# Altium project board.PrjPCB
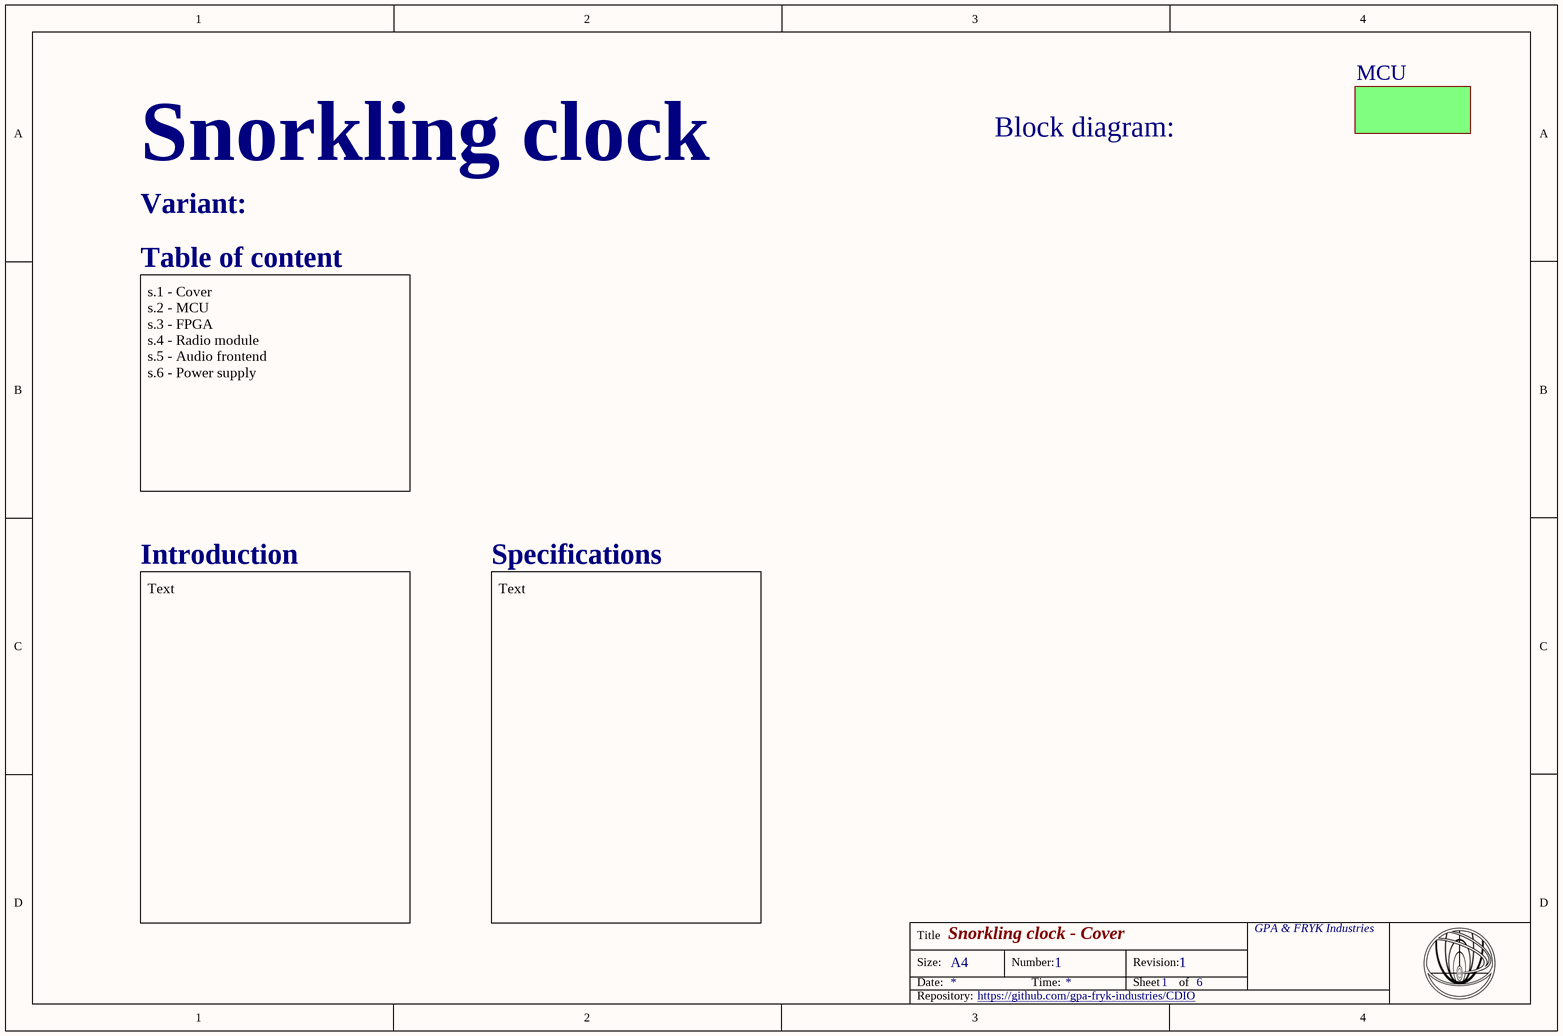
[diagram p0: cover.SchDoc]
project_name: Snorkling clock; project_revision: 1; project_vcs_url: https://github.com/gpa-fryk-industries/CDIO
6 sheets, 96 parts. Net scope: hierarchical (ports join the sheet entries above them; power ports are global).
Board file: board.PcbDoc
Sheets:
  cover.SchDoc
    MCU = mcu.SchDoc
      POWER = power.SchDoc
      FPGA = fpga.SchDoc
      RADIO = radio.SchDoc
      AUDIO = audio.SchDoc

## Sheet cover.SchDoc
size A4; Organization: GPA & FRYK Industries; DocumentNumber: 1; Revision: REV 0; SheetNumber: 1; SheetTotal: 6

### Sub-sheets
MCU = mcu.SchDoc: no entries

### Notes on the sheet
- Block diagram:
- Table of content
- s.1 - Cover
  s.2 - MCU
  s.3 - FPGA
  s.4 - Radio module
  s.5 - Audio frontend
  s.6 - Power supply
- Introduction
- Specifications
- Text
- Variant:
- Title
- Size:
- Date:
- A4
- Number:
- Time:
- Revision:
- Sheet
- of
- Repository:

## Sheet mcu.SchDoc: MCU
size A4; Organization: GPA & FRYK Industries; DocumentNumber: 2; Revision: REV 0; SheetNumber: 2; SheetTotal: 6
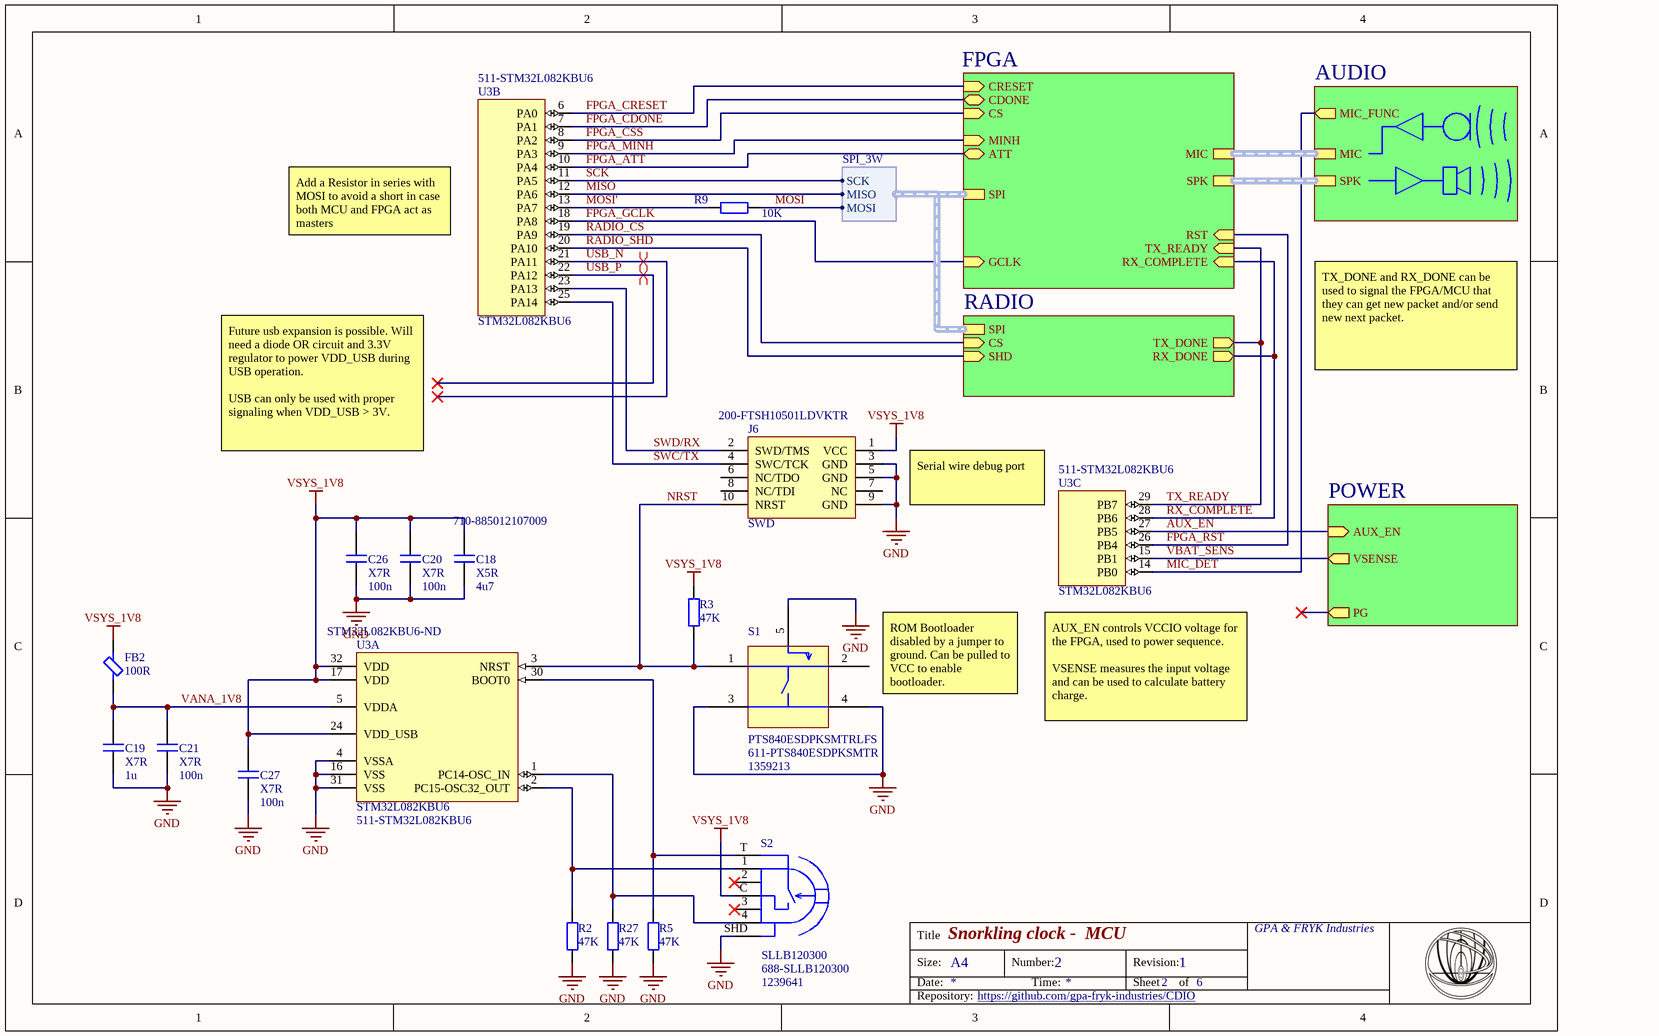
[diagram p1: mcu.SchDoc]

### Parts
C18  value 4u7  type: X5R  Supplier Part Number 1: 710-885012107009  [CAPC2012X11N]  (hidden comment: cap)
C19  value 1u  type: X7R  [CAPC2012X11N]  (hidden comment: cap)
C20  value 100n  type: X7R  [CAPC1005X06N]  (hidden comment: cap)
C21  value 100n  type: X7R  [CAPC1005X06N]  (hidden comment: cap)
C26  value 100n  type: X7R  [CAPC1005X06N]  (hidden comment: cap)
C27  value 100n  type: X7R  [CAPC1005X06N]  (hidden comment: cap)
FB2  value 100R  [INDC1005X06N]  (hidden comment: ferrite)
J6  SWD  Supplier Part Number 1: 200-FTSH10501LDVKTR  [hdr_2x5_50mil]
R2  value 47K  [RESC1005X04N]  (hidden comment: res)
R3  value 47K  [RESC1005X04N]  (hidden comment: res)
R5  value 47K  [RESC1005X04N]  (hidden comment: res)
R9  value 10K  [RESC1005X04N]  (hidden comment: res)
R27  value 47K  [RESC1005X04N]  (hidden comment: res)
S1  PTS840ESDPKSMTRLFS  Supplier Part Number 1: 611-PTS840ESDPKSMTR  Supplier Part Number 2: 1359213  [PCBComponent_1]
S2  SLLB120300  Supplier Part Number 1: 688-SLLB120300  Supplier Part Number 2: 1239641  [sllb120300]
U3  STM32L082KBU6  Supplier Part Number 1: 511-STM32L082KBU6  Supplier Part Number 2: STM32L082KBU6-ND  [QFN50P500X500X60_HS-33N]  (parts A,B,C of 3)

### Sub-sheets
AUDIO = audio.SchDoc: MIC (harness PDM), SPK (harness PWM_D), MIC_FUNC (out)
FPGA = fpga.SchDoc: SPI (harness SPI_3W), MIC (harness PDM), SPK (harness PWM_D), CS (in), CDONE (bidir), GCLK (in), CRESET (in), ATT (bidir), MINH (in), TX_READY (in), RX_COMPLETE (in), RST (in)
POWER = power.SchDoc: AUX_EN (in), VSENSE (out), PG (out)
RADIO = radio.SchDoc: SPI (harness SPI_3W), CS (in), TX_DONE (out), RX_DONE (out), SHD (in)

### Harnesses
SPI_3W: MOSI, MISO, SCK

### Nets
GND: C18.1 C19.1 C20.2 C21.2 C26.2 C27.2 J6.3(GND) J6.5(GND) J6.9(GND) R2.1 R5.1 R27.1 S1.3 S1.4 S1.5 S2.SHD U3.4(VSSA) U3.16(VSS) U3.31(VSS)
VSYS_1V8: C18.2 C20.1 C26.1 C27.1 FB2.2 J6.1(VCC) R3.2 S2.C U3.17(VDD) U3.24(VDD_USB) U3.32(VDD)
AUX_EN: U3.27(PB5) ; sheet POWER/AUX_EN
FPGA_ATT: U3.10(PA4) ; sheet FPGA/ATT
FPGA_CDONE: U3.7(PA1) ; sheet FPGA/CDONE
FPGA_CRESET: U3.6(PA0) ; sheet FPGA/CRESET
FPGA_CSS: U3.8(PA2) ; sheet FPGA/CS
FPGA_GCLK: U3.18(PA8) ; sheet FPGA/GCLK
FPGA_MINH: U3.9(PA3) ; sheet FPGA/MINH
FPGA_RST: U3.26(PB4) ; sheet FPGA/RST
MIC_DET: U3.14(PB0) ; sheet AUDIO/MIC_FUNC
MISO: U3.12(PA6) ; sheet FPGA/SPI.MISO
MOSI: R9.2 ; sheet FPGA/SPI.MOSI
MOSI': R9.1 U3.13(PA7)
NRST: J6.10(NRST) R3.1 S1.1 U3.3(NRST)
RADIO_CS: U3.19(PA9) ; sheet RADIO/CS
RADIO_SHD: U3.20(PA10) ; sheet RADIO/SHD
RX_COMPLETE: U3.28(PB6) ; sheet FPGA/RX_COMPLETE, sheet RADIO/RX_DONE
SCK: U3.11(PA5) ; sheet FPGA/SPI.SCK  [project net P_SCK]
SWC/TX: J6.4(SWC/TCK) U3.25(PA14)
SWD/RX: J6.2(SWD/TMS) U3.23(PA13)
TX_READY: U3.29(PB7) ; sheet FPGA/TX_READY, sheet RADIO/TX_DONE
USB_N: U3.21(PA11)
USB_P: U3.22(PA12)
VANA_1V8: C19.2 C21.1 FB2.1 U3.5(VDDA)
VBAT_SENS: U3.15(PB1) ; sheet POWER/VSENSE
NetR2_2: R2.2 S2.1 U3.2(PC15-OSC32_OUT)
NetR5_2: R5.2 S2.T U3.30(BOOT0)
NetR27_2: R27.2 S2.4 U3.1(PC14-OSC_IN)

Not connected (* = marked no-connect by the designer): J6 6(NC/TDO) 7(NC) 8(NC/TDI); S1 2; S2 2* 3*

### Buses and harness runs
harness sheet AUDIO/MIC = sheet FPGA/MIC
harness sheet AUDIO/SPK = sheet FPGA/SPK
harness sheet FPGA/SPI = sheet RADIO/SPI

### Layout directives
differential pair: USB_N, USB_P

### Notes on the sheet
- Add a Resistor in series with MOSI to avoid a short in case both MCU and FPGA act as masters
- TX_DONE and RX_DONE can be used to signal the FPGA/MCU that they can get new packet and/or send new next packet.
- Future usb expansion is possible. Will need a diode OR circuit and 3.3V regulator to power VDD_USB during USB operation.
  USB can only be used with proper signaling when VDD_USB > 3V.
- Serial wire debug port
- ROM Bootloader disabled by a jumper to ground. Can be pulled to VCC to enable bootloader.
- (near U3) AUX_EN controls VCCIO voltage for the FPGA, used to power sequence.
  VSENSE measures the input voltage and can be used to calculate battery charge.
- Title
- Size:
- Date:
- A4
- Number:
- Time:
- Revision:
- Sheet
- of
- Repository:

### Library data of the parts
C18-C21 C26 C27 = cap: Capacitor; voltage: *; #digikey: *; #mouser: *; Supplier 1: Mouser
  C19: Supplier Part Number 1: 77-VJ0805Y105MXQTBC
  C20 C21 C26 C27: Supplier Part Number 1: 81-GCM155R71H103KA5J
FB2 = ferrite: Inductor; #digikey: *; #mouser: *; Supplier 1: Mouser; Supplier Part Number 1: 810-MMZ1005S102HT000
J6 = hdr_swd: SWD Header; Supplier 1: Mouser
R2 R3 R5 R9 R27 = res: Resistor; power: *; voltage: *; #digikey: *; #mouser: *
S1 = pts840esdpksmtrlfs: Microminiature SMT Side Actuated tactile switch; ComponentLink1Description: datasheet; ComponentLink1URL: https://www.mouser.se/datasheet/2/60/pts840-1280343.pdf; Supplier 1: Mouser; Supplier 2: RSComponents
S2 = sllb120300: Compact and low-profile horizontal type for various applications; ComponentLink1Description: datasheet; ComponentLink1URL: https://www.mouser.se/datasheet/2/15/SLLB-1370969.pdf; Supplier 1: Mouser; Supplier 2: RSComponents
U3 = stm32l082kbu6: Ultra-low-power 32-bit MCU Arm-based Cortex-M0+, up to 192KB / Flash, 20KB SRAM, 6KB EEPROM, USB, ADC, DACs, AES; ComponentLink1Description: datasheet; ComponentLink1URL: https://www.mouser.se/datasheet/2/389/stm32l082kb-956309.pdf; Supplier 1: Mouser; Supplier 2: Digi-Key

## Sheet power.SchDoc: Power supply
size A4; Organization: GPA & FRYK Industries; DocumentNumber: 6; Revision: REV 0; SheetNumber: 6; SheetTotal: 6
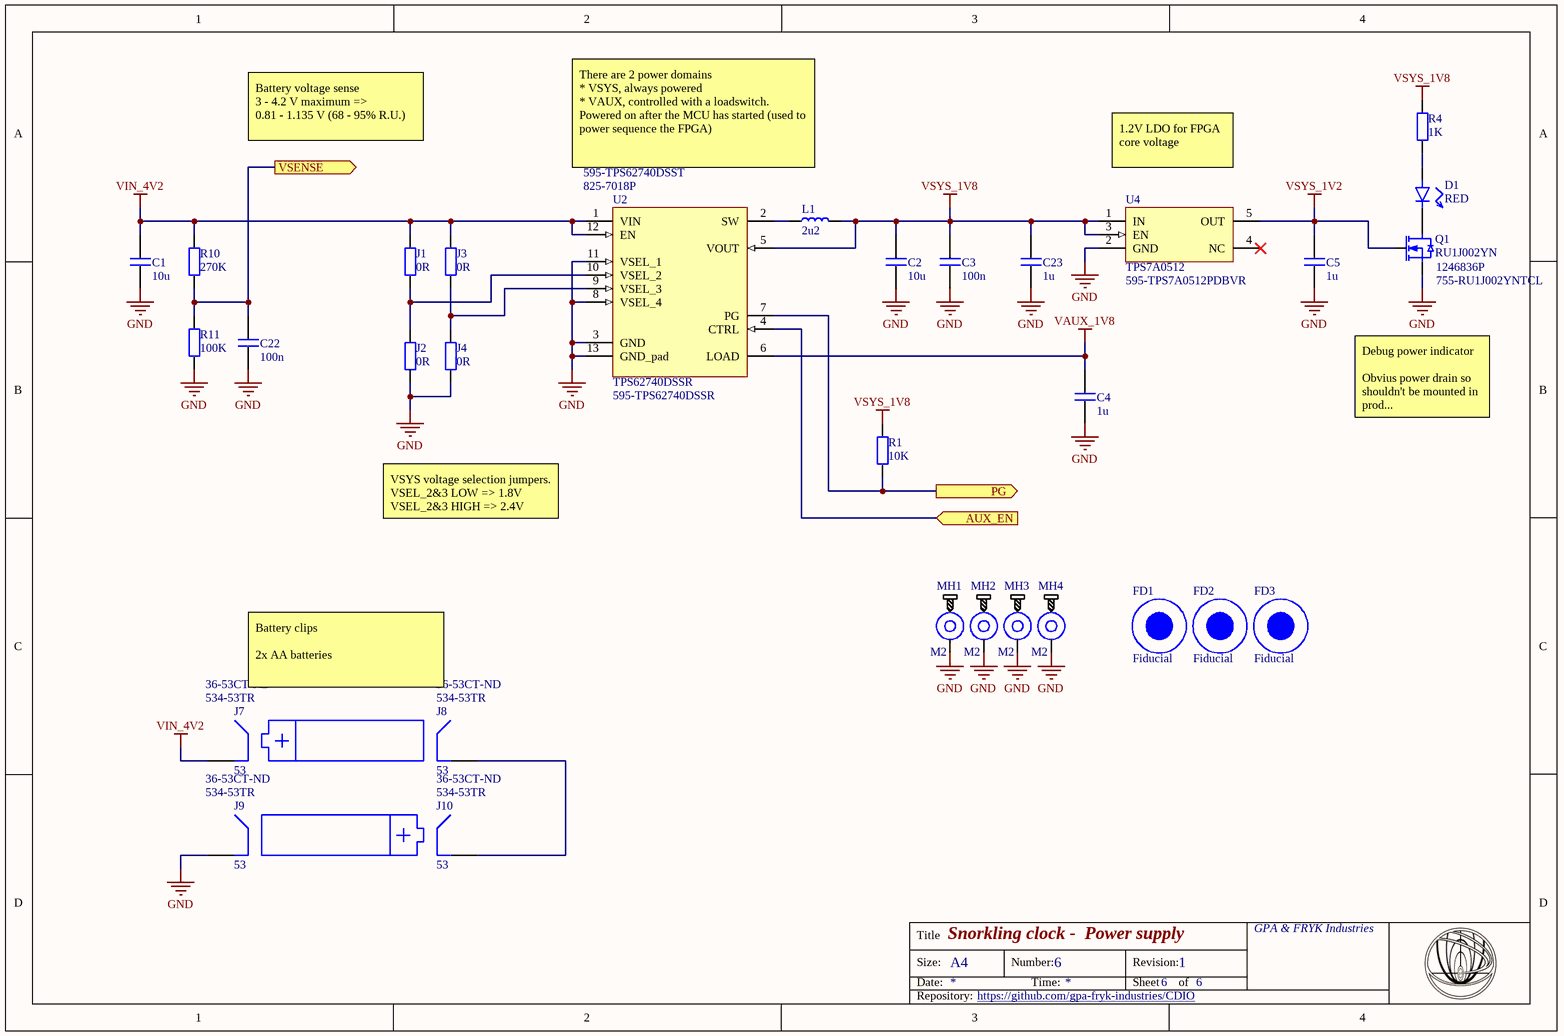
[diagram p2: power.SchDoc]

### Parts
C1  value 10u  [CAPC3216X14N]  (hidden comment: cap)
C2  value 10u  [CAPC3216X14N]  (hidden comment: cap)
C3  value 100n  [CAPC1005X06N]  (hidden comment: cap)
C4  value 1u  [CAPC2012X11N]  (hidden comment: cap)
C5  value 1u  [CAPC2012X11N]  (hidden comment: cap)
C22  value 100n  [CAPC1005X06N]  (hidden comment: cap)
C23  value 1u  [CAPC2012X11N]  (hidden comment: cap)
D1  value RED  [CAPCP1005X06N]  (hidden comment: led)
FD1  Fiducial  [fiducial_1_3]  (no BOM)
FD2  Fiducial  [fiducial_1_3]  (no BOM)
FD3  Fiducial  [fiducial_1_3]  (no BOM)
J1  value 0R  [RESC1005X04N]  (hidden comment: res)
J2  value 0R  [RESC1005X04N]  (hidden comment: res)
J3  value 0R  [RESC1005X04N]  (hidden comment: res)
J4  value 0R  [RESC1005X04N]  (hidden comment: res)
J7  53  Supplier Part Number 1: 534-53TR  Supplier Part Number 2: 36-53CT-ND  [ke53]
J8  53  Supplier Part Number 1: 534-53TR  Supplier Part Number 2: 36-53CT-ND  [ke53]
J9  53  Supplier Part Number 1: 534-53TR  Supplier Part Number 2: 36-53CT-ND  [ke53]
J10  53  Supplier Part Number 1: 534-53TR  Supplier Part Number 2: 36-53CT-ND  [ke53]
L1  value 2u2  [INDC3216X20N]  (hidden comment: ind)
MH1  M2  [mount_m2l]  (no BOM)
MH2  M2  [mount_m2l]  (no BOM)
MH3  M2  [mount_m2l]  (no BOM)
MH4  M2  [mount_m2l]  (no BOM)
Q1  RU1J002YN  Supplier Part Number 1: 1246836P  Supplier Part Number 2: 755-RU1J002YNTCL  [SOTFL65P210X105-3N]
R1  value 10K  [RESC1005X04N]  (hidden comment: res)
R4  value 1K  [RESC1005X04N]  (hidden comment: res)
R10  value 270K  [RESC1005X04N]  (hidden comment: res)
R11  value 100K  [RESC1005X04N]  (hidden comment: res)
U2  TPS62740DSSR  Supplier Part Number 1: 595-TPS62740DSSR  Supplier Part Number 2: 825-7018P  Supplier Part Number 3: 595-TPS62740DSST  [SON50P200X80_HS-13N]
U4  TPS7A0512  Supplier Part Number 1: 595-TPS7A0512PDBVR  [SOT95P280X145-5N]

### Ports
AUX_EN (in), PG (out), VSENSE (out)

### Nets
GND: C1.1 C2.1 C3.1 C4.1 C5.1 C22.1 C23.1 J2.1 J4.1 J9.1 MH1.1 MH2.1 MH3.1 MH4.1 Q1.2(S) R11.1 U2.3(GND) U2.8(VSEL_4) U2.11(VSEL_1) U2.13(GND_pad) U4.2(GND)
VAUX_1V8: C4.2 U2.6(LOAD)
VIN_4V2: C1.2 J1.2 J3.2 J7.1 R10.2 U2.1(VIN) U2.12(EN)
VSYS_1V2: C5.2 Q1.1(G) U4.5(OUT)
VSYS_1V8: C2.2 C3.2 C23.2 L1.2 R1.2 R4.2 U2.5(VOUT) U4.1(IN) U4.3(EN)
AUX_EN: U2.4(CTRL) ; port AUX_EN
VBAT_SENS: C22.2 R10.1 R11.2 ; port VSENSE
NetD1_A: D1.A R4.1
NetD1_C: D1.C Q1.3(D)
NetJ1_1: J1.1 J2.2 U2.10(VSEL_2)
NetJ3_1: J3.1 J4.2 U2.9(VSEL_3)
NetJ8_1: J8.1 J10.1
NetL1_1: L1.1 U2.2(SW)
NetR1_1: R1.1 U2.7(PG) ; port PG

Not connected (* = marked no-connect by the designer): U4 4(NC)*

### Notes on the sheet
- Battery voltage sense
  3 - 4.2 V maximum =>
  0.81 - 1.135 V (68 - 95% R.U.)
- There are 2 power domains
  * VSYS, always powered
  * VAUX, controlled with a loadswitch. Powered on after the MCU has started (used to power sequence the FPGA)
- 1.2V LDO for FPGA core voltage
- Debug power indicator
  Obvius power drain so shouldn't be mounted in prod...
- VSYS voltage selection jumpers.
  VSEL_2&3 LOW => 1.8V
  VSEL_2&3 HIGH => 2.4V
- Battery clips
  2x AA batteries
- Title
- Size:
- Date:
- A4
- Number:
- Time:
- Revision:
- Sheet
- of
- Repository:

### Library data of the parts
C1 C2 = cap: Capacitor; type: X5R; voltage: *; #digikey: *; #mouser: *; Supplier 1: Mouser; Supplier Part Number 1: 810-C3216X5R1C106M
C3-C5 C22 C23 = cap: Capacitor; type: X7R; voltage: *; #digikey: *; #mouser: *; Supplier 1: Mouser
  C3 C22: Supplier Part Number 1: 81-GCM155R71H103KA5J
  C4 C5 C23: Supplier Part Number 1: 77-VJ0805Y105MXQTBC
D1 = led: pin to pad: A>1 C>2; Supplier 1: RSComponents; Supplier Part Number 1: 1332893P; Supplier 2: Mouser; Supplier Part Number 2: 755-SML-P12M2TT86R
J1-J4 R1 R4 R10 R11 = res: Resistor; power: *; voltage: *; #digikey: *; #mouser: *
J7-J10 = ke53: Cylindrical Battery Contacts, Clips, Holders & Springs SMT Battery clip FOR AA; ComponentLink1Description: datasheet; ComponentLink1URL: https://www.mouser.se/datasheet/2/215/3-745929.pdf; Supplier 1: Mouser; Supplier 2: Digi-Key
L1 = ind: Inductor; current: *; #digikey: *; #mouser: *; Supplier 1: Mouser; Supplier Part Number 1: 963-LB3218T2R2M; Supplier 2: RSComponents; Supplier Part Number 2: 755-4703
MH1-MH4 = mounting_hole: Mounting hole
Q1 = ru1j002yn: N-channel 50V 200mA Small signal MOSFET; ComponentLink1Description: datasheet; ComponentLink1URL: https://www.mouser.se/datasheet/2/348/ru1j002yn-e-1018335.pdf; Supplier 1: RSComponents; Supplier 2: Mouser
U2 = tps62740dssr: TPS6274x 360nA IQ Step Down Converter For Low Power Applications; ComponentLink1Description: datasheet; ComponentLink1URL: http://www.ti.com/general/docs/suppproductinfo.tsp?distId=26&gotoUrl=http%3A%2F%2Fwww.ti.com%2Flit%2Fgpn%2Ftps62740; Supplier 1: Mouser; Supplier 2: RSComponents; Supplier 3: Mouser
U4 = tps7a0512pdbvr: TPS7A05 1-µA Ultralow IQ, 200-mA, Low-Dropout Regulator; ComponentLink1Description: datasheet; ComponentLink1URL: http://www.ti.com/lit/ds/symlink/tps7a05.pdf?HQS=TI-null-null-mousermode-df-pf-null-wwe&DCM=yes&ref_url=https%3A%2F%2Fwww.mouser.se%2F; Supplier 1: Mouser

## Sheet fpga.SchDoc: FPGA
size A4; Organization: GPA & FRYK Industries; DocumentNumber: 3; Revision: REV 0; SheetNumber: 3; SheetTotal: 6
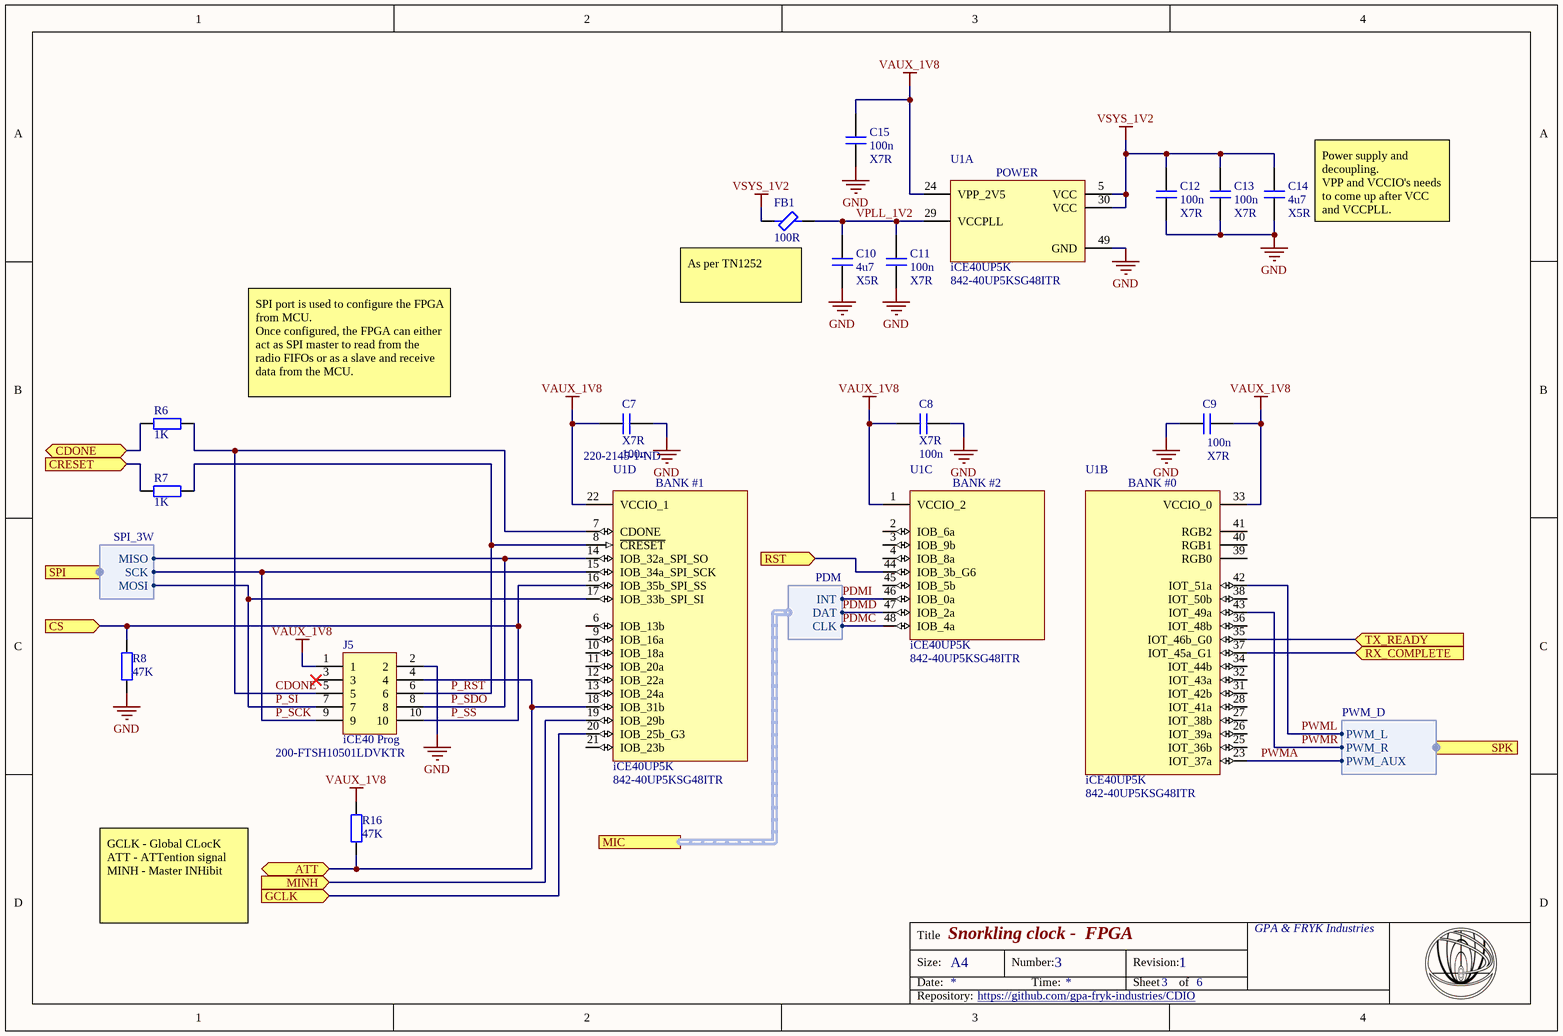
[diagram p3: fpga.SchDoc]

### Parts
C7  value 100n  type: X7R  [CAPC1005X06N]  (hidden comment: cap)
C8  value 100n  type: X7R  [CAPC1005X06N]  (hidden comment: cap)
C9  value 100n  type: X7R  [CAPC1005X06N]  (hidden comment: cap)
C10  value 4u7  type: X5R  [CAPC2012X11N]  (hidden comment: cap)
C11  value 100n  type: X7R  [CAPC1005X06N]  (hidden comment: cap)
C12  value 100n  type: X7R  [CAPC1005X06N]  (hidden comment: cap)
C13  value 100n  type: X7R  [CAPC1005X06N]  (hidden comment: cap)
C14  value 4u7  type: X5R  [CAPC2012X11N]  (hidden comment: cap)
C15  value 100n  type: X7R  [CAPC1005X06N]  (hidden comment: cap)
FB1  value 100R  [INDC1005X06N]  (hidden comment: ferrite)
J5  iCE40 Prog  Supplier Part Number 1: 200-FTSH10501LDVKTR  [hdr_2x5_50mil]
R6  value 1K  [RESC1005X04N]  (hidden comment: res)
R7  value 1K  [RESC1005X04N]  (hidden comment: res)
R8  value 47K  [RESC1005X04N]  (hidden comment: res)
R16  value 47K  [RESC1005X04N]  (hidden comment: res)
U1  iCE40UP5K  Supplier Part Number 1: 842-40UP5KSG48ITR  [QFN127P600-8N-ICE40UP5K]  (parts A,B,C,D of 4)

### Ports
ATT (bidir), CDONE (bidir), CRESET (in), CS (in), GCLK (in), MIC (harness PDM), MINH (in), RST (in), RX_COMPLETE (in), SPI (harness SPI_3W), SPK (harness PWM_D), TX_READY (in)

### Harnesses
SPI_3W: MOSI, MISO, SCK
PWM_D: PWM_R, PWM_L, PWM_AUX
PDM: DAT, CLK, INT

### Nets
GND: C7.1 C8.1 C9.1 C10.1 C11.1 C12.2 C13.2 C14.1 C15.1 J5.2 R8.1 U1.49(GND)
VAUX_1V8: C7.2 C8.2 C9.2 C15.2 J5.1 R16.2 U1.1(VCCIO_2) U1.22(VCCIO_1) U1.24(VPP_2V5) U1.33(VCCIO_0)
VSYS_1V2: C12.1 C13.1 C14.2 FB1.1 U1.5(VCC) U1.30(VCC)
CDONE: J5.5 R6.1 U1.7(CDONE)
FPGA_ATT: J5.4 R16.1 U1.18(IOB_31b) ; port ATT
FPGA_CDONE: R6.2 ; port CDONE
FPGA_CRESET: R7.2 ; port CRESET
FPGA_GCLK: U1.20(IOB_25b_G3) ; port GCLK
FPGA_MINH: U1.19(IOB_29b) ; port MINH
FPGA_RST: U1.44(IOB_3b_G6) ; port RST
P_RST: J5.6 R7.1 U1.8(~{CRESET})
P_SCK: J5.9 U1.15(IOB_34a_SPI_SCK) ; port SPI.SCK
P_SDO: J5.8 U1.14(IOB_32a_SPI_SO) ; port SPI.MISO  [project net MISO]
P_SI: J5.7 U1.17(IOB_33b_SPI_SI) ; port SPI.MOSI  [project net MOSI]
P_SS: J5.10 R8.2 U1.16(IOB_35b_SPI_SS) ; port CS  [project net FPGA_CSS]
PDMC: U1.48(IOB_4a) ; port MIC.CLK
PDMD: U1.47(IOB_2a) ; port MIC.DAT
PDMI: U1.46(IOB_0a) ; port MIC.INT
PWMA: U1.23(IOT_37a) ; port SPK.PWM_AUX
PWML: U1.42(IOT_51a) ; port SPK.PWM_L
PWMR: U1.43(IOT_49a) ; port SPK.PWM_R
RX_COMPLETE: U1.37(IOT_45a_G1) ; port RX_COMPLETE
TX_READY: U1.35(IOT_46b_G0) ; port TX_READY
VPLL_1V2: C10.2 C11.2 FB1.2 U1.29(VCCPLL)

Not connected (* = marked no-connect by the designer): J5 3*; U1 2(IOB_6a) 3(IOB_9b) 4(IOB_8a) 6(IOB_13b) 9(IOB_16a) 10(IOB_18a) 11(IOB_20a) 12(IOB_22a) 13(IOB_24a) 21(IOB_23b) 25(IOT_36b) 26(IOT_39a) 27(IOT_38b) 28(IOT_41a) 31(IOT_42b) 32(IOT_43a) 34(IOT_44b) 36(IOT_48b) 38(IOT_50b) 39(RGB0) 40(RGB1) 41(RGB2) 45(IOB_5b)

### Notes on the sheet
- (near C14) Power supply and decoupling.
  VPP and VCCIO's needs to come up after VCC and VCCPLL.
- As per TN1252
- SPI port is used to configure the FPGA from MCU.
  Once configured, the FPGA can either act as SPI master to read from the radio FIFOs or as a slave and receive data from the MCU.
- GCLK - Global CLocK
  ATT - ATTention signal
  MINH - Master INHibit
- Title
- Size:
- Date:
- A4
- Number:
- Time:
- Revision:
- Sheet
- of
- Repository:
- (in symbol ice40up5k-sg48, part A) POWER
- (in symbol ice40up5k-sg48, part B) BANK #0
- (in symbol ice40up5k-sg48, part C) BANK #2
- (in symbol ice40up5k-sg48, part D) BANK #1

### Library data of the parts
C7-C15 = cap: Capacitor; voltage: *; #digikey: *; #mouser: *; Supplier 1: Mouser
  C7-C9 C11-C13 C15: Supplier Part Number 1: 81-GCM155R71H103KA5J
  C10 C14: Supplier Part Number 1: 710-885012107009
FB1 = ferrite: Inductor; #digikey: *; #mouser: *; Supplier 1: Mouser; Supplier Part Number 1: 810-MMZ1005S102HT000
J5 = hdr_2x5: 2x5 Header; Supplier 1: Mouser
R6-R8 R16 = res: Resistor; power: *; voltage: *; #digikey: *; #mouser: *
U1 = ice40up5k-sg48: iCE40 UltraPlus family from Lattice Semiconductor is / an ultra-low power FPGA and sensor manager / designed for ultra / - / low power mobile a / pplications, such / as smartphones, tablets and hand-held devices.; ComponentLink1Description: datasheet; ComponentLink1URL: https://www.mouser.se/datasheet/2/225/iCE40%20UltraPlus%20Family%20Data%20Sheet-1149905.pdf; Supplier 1: Mouser

## Sheet radio.SchDoc: Radio module
size A4; Organization: GPA & FRYK Industries; DocumentNumber: 4; Revision: REV 0; SheetNumber: 4; SheetTotal: 6
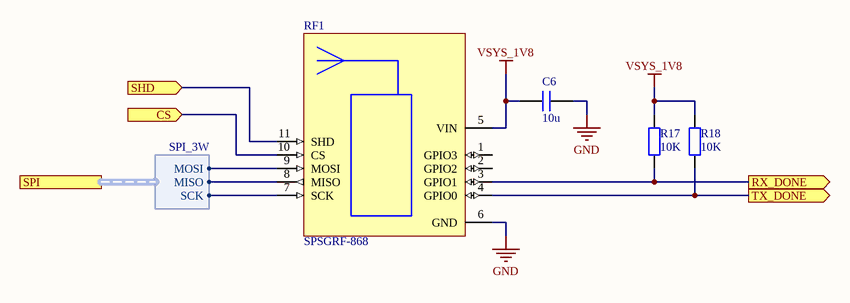
[diagram p4: radio.SchDoc]

### Parts
C6  value 10u  [CAPC3216X14N]  (hidden comment: cap)
R17  value 10K  [RESC1005X04N]  (hidden comment: res)
R18  value 10K  [RESC1005X04N]  (hidden comment: res)
RF1  SPSGRF-868  [spsgrf]

### Ports
CS (in), RX_DONE (out), SHD (in), SPI (harness SPI_3W), TX_DONE (out)

### Harnesses
SPI_3W: MOSI, MISO, SCK

### Nets
GND: C6.2 RF1.6(GND)
VSYS_1V8: C6.1 R17.2 R18.2 RF1.5(VIN)
MISO: RF1.8(MISO) ; port SPI.MISO
MOSI: RF1.9(MOSI) ; port SPI.MOSI
P_SCK: RF1.7(SCK) ; port SPI.SCK
RADIO_CS: RF1.10(CS) ; port CS
RADIO_SHD: RF1.11(SHD) ; port SHD
RX_COMPLETE: R17.1 RF1.3(GPIO1) ; port RX_DONE
TX_READY: R18.1 RF1.4(GPIO0) ; port TX_DONE

Not connected (* = marked no-connect by the designer): RF1 1(GPIO3) 2(GPIO2)

### Notes on the sheet
- Title
- Size:
- Date:
- A4
- Number:
- Time:
- Revision:
- Sheet
- of
- Repository:

### Library data of the parts
C6 = cap: Capacitor; type: X5R; voltage: *; #digikey: *; #mouser: *; Supplier 1: Mouser; Supplier Part Number 1: 810-C3216X5R1C106M
R17 R18 = res: Resistor; power: *; voltage: *; #digikey: *; #mouser: *
RF1 = spsgrf-868: Sub-GHz (868 or 915 MHz) low power programmable RF / transceiver modules; ComponentLink1Description: datasheet; ComponentLink1URL: https://www.mouser.se/datasheet/2/389/spsgrf-955290.pdf

## Sheet audio.SchDoc: Audio frontend
size A4; Organization: GPA & FRYK Industries; DocumentNumber: 5; Revision: REV 0; SheetNumber: 5; SheetTotal: 6
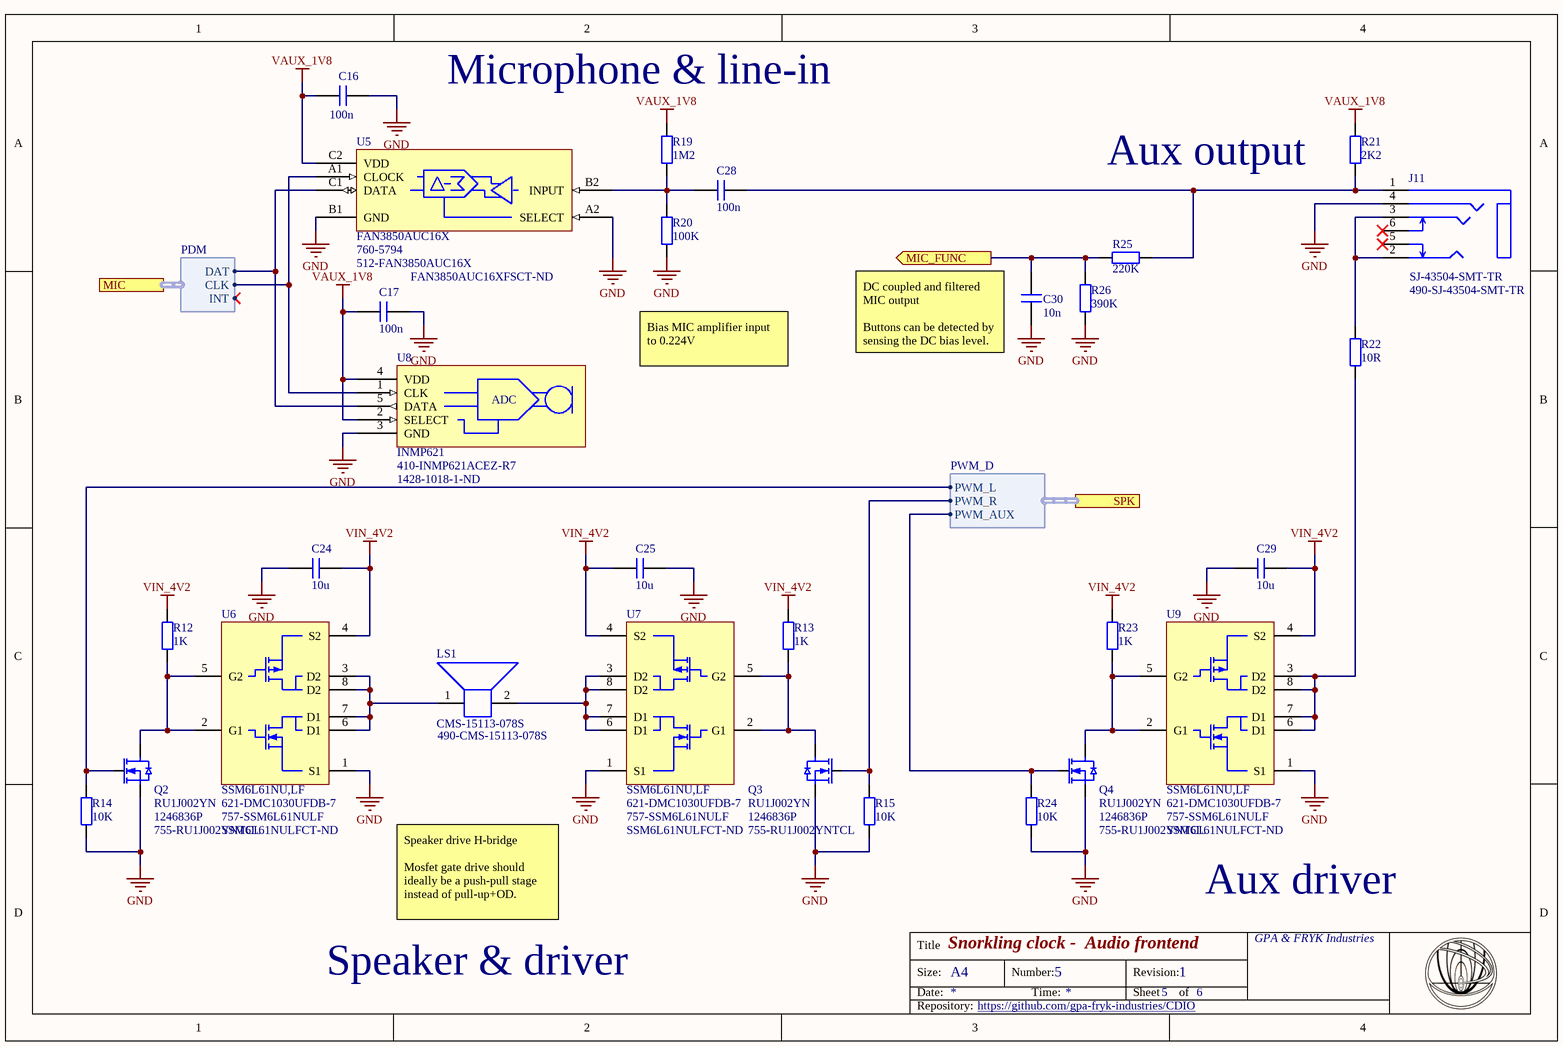
[diagram p5: audio.SchDoc]

### Parts
C16  value 100n  [CAPC1005X06N]  (hidden comment: cap)
C17  value 100n  [CAPC1005X06N]  (hidden comment: cap)
C24  value 10u  [CAPC3216X14N]  (hidden comment: cap)
C25  value 10u  [CAPC3216X14N]  (hidden comment: cap)
C28  value 100n  [CAPC1005X06N]  (hidden comment: cap)
C29  value 10u  [CAPC3216X14N]  (hidden comment: cap)
C30  value 10n  [CAPC1005X06N]  (hidden comment: cap)
J11  SJ-43504-SMT-TR  Supplier Part Number 1: 490-SJ-43504-SMT-TR  [SJ-43504-SMT-TR]
LS1  CMS-15113-078S  Supplier Part Number 1: 490-CMS-15113-078S  [cms-15113-078s]
Q2  RU1J002YN  Supplier Part Number 1: 1246836P  Supplier Part Number 2: 755-RU1J002YNTCL  [SOTFL65P210X105-3N]
Q3  RU1J002YN  Supplier Part Number 1: 1246836P  Supplier Part Number 2: 755-RU1J002YNTCL  [SOTFL65P210X105-3N]
Q4  RU1J002YN  Supplier Part Number 1: 1246836P  Supplier Part Number 2: 755-RU1J002YNTCL  [SOTFL65P210X105-3N]
R12  value 1K  [RESC1005X04N]  (hidden comment: res)
R13  value 1K  [RESC1005X04N]  (hidden comment: res)
R14  value 10K  [RESC1005X04N]  (hidden comment: res)
R15  value 10K  [RESC1005X04N]  (hidden comment: res)
R19  value 1M2  [RESC1005X04N]  (hidden comment: res)
R20  value 100K  [RESC1005X04N]  (hidden comment: res)
R21  value 2K2  [RESC1005X04N]  (hidden comment: res)
R22  value 10R  [RESC2012X06N]  (hidden comment: res)
R23  value 1K  [RESC1005X04N]  (hidden comment: res)
R24  value 10K  [RESC1005X04N]  (hidden comment: res)
R25  value 220K  [RESC1005X04N]  (hidden comment: res)
R26  value 390K  [RESC1005X04N]  (hidden comment: res)
U5  FAN3850AUC16X  Supplier Part Number 1: 760-5794  Supplier Part Number 2: 512-FAN3850AUC16X  Supplier Part Number 3: FAN3850AUC16XFSCT-ND  [BGA6C48P2X3_86X126X30]
U6  SSM6L61NU,LF  Supplier Part Number 1: 621-DMC1030UFDB-7  Supplier Part Number 2: 757-SSM6L61NULF  Supplier Part Number 3: SSM6L61NULFCT-ND  [SON65P200X80_HS-7N]
U7  SSM6L61NU,LF  Supplier Part Number 1: 621-DMC1030UFDB-7  Supplier Part Number 2: 757-SSM6L61NULF  Supplier Part Number 3: SSM6L61NULFCT-ND  [SON65P200X80_HS-7N]
U8  INMP621  Supplier Part Number 1: 410-INMP621ACEZ-R7  Supplier Part Number 2: 1428-1018-1-ND  [SON70P300X90-4N]
U9  SSM6L61NU,LF  Supplier Part Number 1: 621-DMC1030UFDB-7  Supplier Part Number 2: 757-SSM6L61NULF  Supplier Part Number 3: SSM6L61NULFCT-ND  [SON65P200X80_HS-7N]

### Ports
MIC (harness PDM), MIC_FUNC (out), SPK (harness PWM_D)

### Harnesses
PDM: DAT, CLK, INT
PWM_D: PWM_R, PWM_L, PWM_AUX

### Nets
GND: C16.1 C17.1 C24.2 C25.1 C29.1 C30.1 J11.4 Q2.2(S) Q3.2(S) Q4.2(S) R14.1 R15.1 R20.1 R24.1 R26.2 U5.A2(SELECT) U5.B1(GND) U6.1(S1) U7.1(S1) U8.3(GND) U9.1(S1)
VAUX_1V8: C16.2 C17.2 R19.2 R21.1 U5.C2(VDD) U8.2(SELECT) U8.4(VDD)
VIN_4V2: C24.1 C25.2 C29.2 R12.2 R13.2 R23.2 U6.4(S2) U7.4(S2) U9.4(S2)
MIC_DET: C30.2 R25.2 R26.1 ; port MIC_FUNC
PDMC: U5.A1(CLOCK) U8.1(CLK) ; port MIC.CLK
PDMD: U5.C1(DATA) U8.5(DATA) ; port MIC.DAT
PWMA: Q4.1(G) R24.2 ; port SPK.PWM_AUX
PWML: Q2.1(G) R14.2 ; port SPK.PWM_L
PWMR: Q3.1(G) R15.2 ; port SPK.PWM_R
NetC28_1: C28.1 R19.1 R20.2 U5.B2(INPUT)
NetC28_2: C28.2 J11.1 R21.2 R25.1
NetJ11_2: J11.2 J11.3 R22.2
NetLS1_1: LS1.1 U6.3(D2) U6.6(D1) U6.7(D1) U6.8(D2)
NetLS1_2: LS1.2 U7.3(D2) U7.6(D1) U7.7(D1) U7.8(D2)
NetQ2_3: Q2.3(D) R12.1 U6.2(G1) U6.5(G2)
NetQ3_3: Q3.3(D) R13.1 U7.2(G1) U7.5(G2)
NetQ4_3: Q4.3(D) R23.1 U9.2(G1) U9.5(G2)
NetR22_1: R22.1 U9.3(D2) U9.6(D1) U9.7(D1) U9.8(D2)

Not connected (* = marked no-connect by the designer): J11 5(4)* 6(4)*

### Notes on the sheet
- (near R19) Microphone & line-in
- (near R21) Aux output
- Bias MIC amplifier input to 0.224V
- (near C30) DC coupled and filtered MIC output
  Buttons can be detected by sensing the DC bias level.
- Speaker drive H-bridge
  Mosfet gate drive should ideally be a push-pull stage instead of pull-up+OD.
- Aux driver
- Speaker & driver
- Title
- Size:
- Date:
- A4
- Number:
- Time:
- Revision:
- Sheet
- of
- Repository:
- (in symbol inmp621) ADC

### Library data of the parts
C16 C17 C28 C30 = cap: Capacitor; type: X7R; voltage: *; #digikey: *; #mouser: *
  C16 C17 C28: Supplier 1: Mouser; Supplier Part Number 1: 81-GCM155R71H103KA5J
C24 C25 C29 = cap: Capacitor; type: X5R; voltage: *; #digikey: *; #mouser: *; Supplier 1: Mouser; Supplier Part Number 1: 810-C3216X5R1C106M
J11 = sj-43504-smt-tr: MID MOUNT AUDIO JACK; ComponentLink1Description: datasheet; ComponentLink1URL: https://www.mouser.se/datasheet/2/670/sj-43504-smt-1391171.pdf; Supplier 1: Mouser
LS1 = cms-15113-078s: Speakers & Transducers 0.7W 8ohm 700Hz 15x11mm SpringContct; ComponentLink1Description: datasheet; ComponentLink1URL: https://www.mouser.se/datasheet/2/670/cms-15113-078x-1315382.pdf; Supplier 1: Mouser
Q2-Q4 = ru1j002yn: N-channel 50V 200mA Small signal MOSFET; ComponentLink1Description: datasheet; ComponentLink1URL: https://www.mouser.se/datasheet/2/348/ru1j002yn-e-1018335.pdf; Supplier 1: RSComponents; Supplier 2: Mouser
R12-R15 R19-R26 = res: Resistor; power: *; voltage: *; #digikey: *; #mouser: *
U5 = fan3850auc16x: Microphone Pre-Amplifier with Digital Output; ComponentLink1Description: datasheet; ComponentLink1URL: https://www.mouser.se/datasheet/2/308/FAN3850A-1305296.pdf; #digikey: *; #mouser: *; Supplier 1: RSComponents; Supplier 2: Mouser; Supplier 3: Digi-Key
U6 U7 U9 = ssm6l61nulf: 2 MOSFET in one package. 1 NMOS and one PMOS.; ComponentLink1Description: datasheet; ComponentLink1URL: http://toshiba.semicon-storage.com/ap-en/product/mosfet/detail.SSM6L61NU.html; Supplier 1: Mouser; Supplier 2: Mouser; Supplier 3: Digi-Key
U8 = inmp621: Wide Dynamic Range Microphone with PDM Digital Output; ComponentLink1Description: datasheet; ComponentLink1URL: https://www.invensense.com/wp-content/uploads/2015/02/INMP621.pdf; Supplier 1: Mouser; Supplier 2: Digi-Key

## Nets that join several sheets
GND: mcu (19 pins), power (21 pins), fpga (12 pins), radio (C6.2 RF1.6), audio (21 pins)
VAUX_1V8: power (C4.2 U2.6), fpga (10 pins), audio (7 pins)
VIN_4V2: power (7 pins), audio (9 pins)
VSYS_1V2: power (C5.2 Q1.1 U4.5), fpga (6 pins)
VSYS_1V8: mcu (11 pins), power (9 pins), radio (C6.1 R17.2 R18.2 RF1.5)
AUX_EN: mcu (U3.27), power (U2.4)
FPGA_ATT: mcu (U3.10), fpga (J5.4 R16.1 U1.18)
FPGA_CDONE: mcu (U3.7), fpga (R6.2)
FPGA_CRESET: mcu (U3.6), fpga (R7.2)
FPGA_CSS: mcu (U3.8), fpga (J5.10 R8.2 U1.16)
FPGA_GCLK: mcu (U3.18), fpga (U1.20)
FPGA_MINH: mcu (U3.9), fpga (U1.19)
FPGA_RST: mcu (U3.26), fpga (U1.44)
MIC_DET: mcu (U3.14), audio (C30.2 R25.2 R26.1)
MISO: mcu (U3.12), fpga (J5.8 U1.14), radio (RF1.8)
MOSI: mcu (R9.2), fpga (J5.7 U1.17), radio (RF1.9)
P_SCK: mcu (U3.11), fpga (J5.9 U1.15), radio (RF1.7)
PDMC: fpga (U1.48), audio (U5.A1 U8.1)
PDMD: fpga (U1.47), audio (U5.C1 U8.5)
PWMA: fpga (U1.23), audio (Q4.1 R24.2)
PWML: fpga (U1.42), audio (Q2.1 R14.2)
PWMR: fpga (U1.43), audio (Q3.1 R15.2)
RADIO_CS: mcu (U3.19), radio (RF1.10)
RADIO_SHD: mcu (U3.20), radio (RF1.11)
RX_COMPLETE: mcu (U3.28), fpga (U1.37), radio (R17.1 RF1.3)
TX_READY: mcu (U3.29), fpga (U1.35), radio (R18.1 RF1.4)
VBAT_SENS: mcu (U3.15), power (C22.2 R10.1 R11.2)

## Assembly variants
EUROPE: not fitted D1 J1 J3 Q1 R4; alternate parts RF1 -> spsgrf-868
AMERICA: not fitted D1 J1 J3 Q1 R4; alternate parts RF1 -> spsgrf-915
EUROPE_STRIPPED: not fitted C16 C28 C29 C30 D1 J1 J3 J5 J6 J11 Q1 Q4 R4 R19 R20 R21 R22 R23 R24 R25 R26 S1 U5 U9; alternate parts RF1 -> spsgrf-868
AMERICA_STRIPPED: not fitted C16 C28 C29 C30 D1 J1 J3 J5 J6 J11 Q1 Q4 R4 R19 R20 R21 R22 R23 R24 R25 R26 S1 U5 U9; alternate parts RF1 -> spsgrf-915